# Altium schematic sheet Sheet_1_2021-03-24.schdoc
size 399 x 334 mm
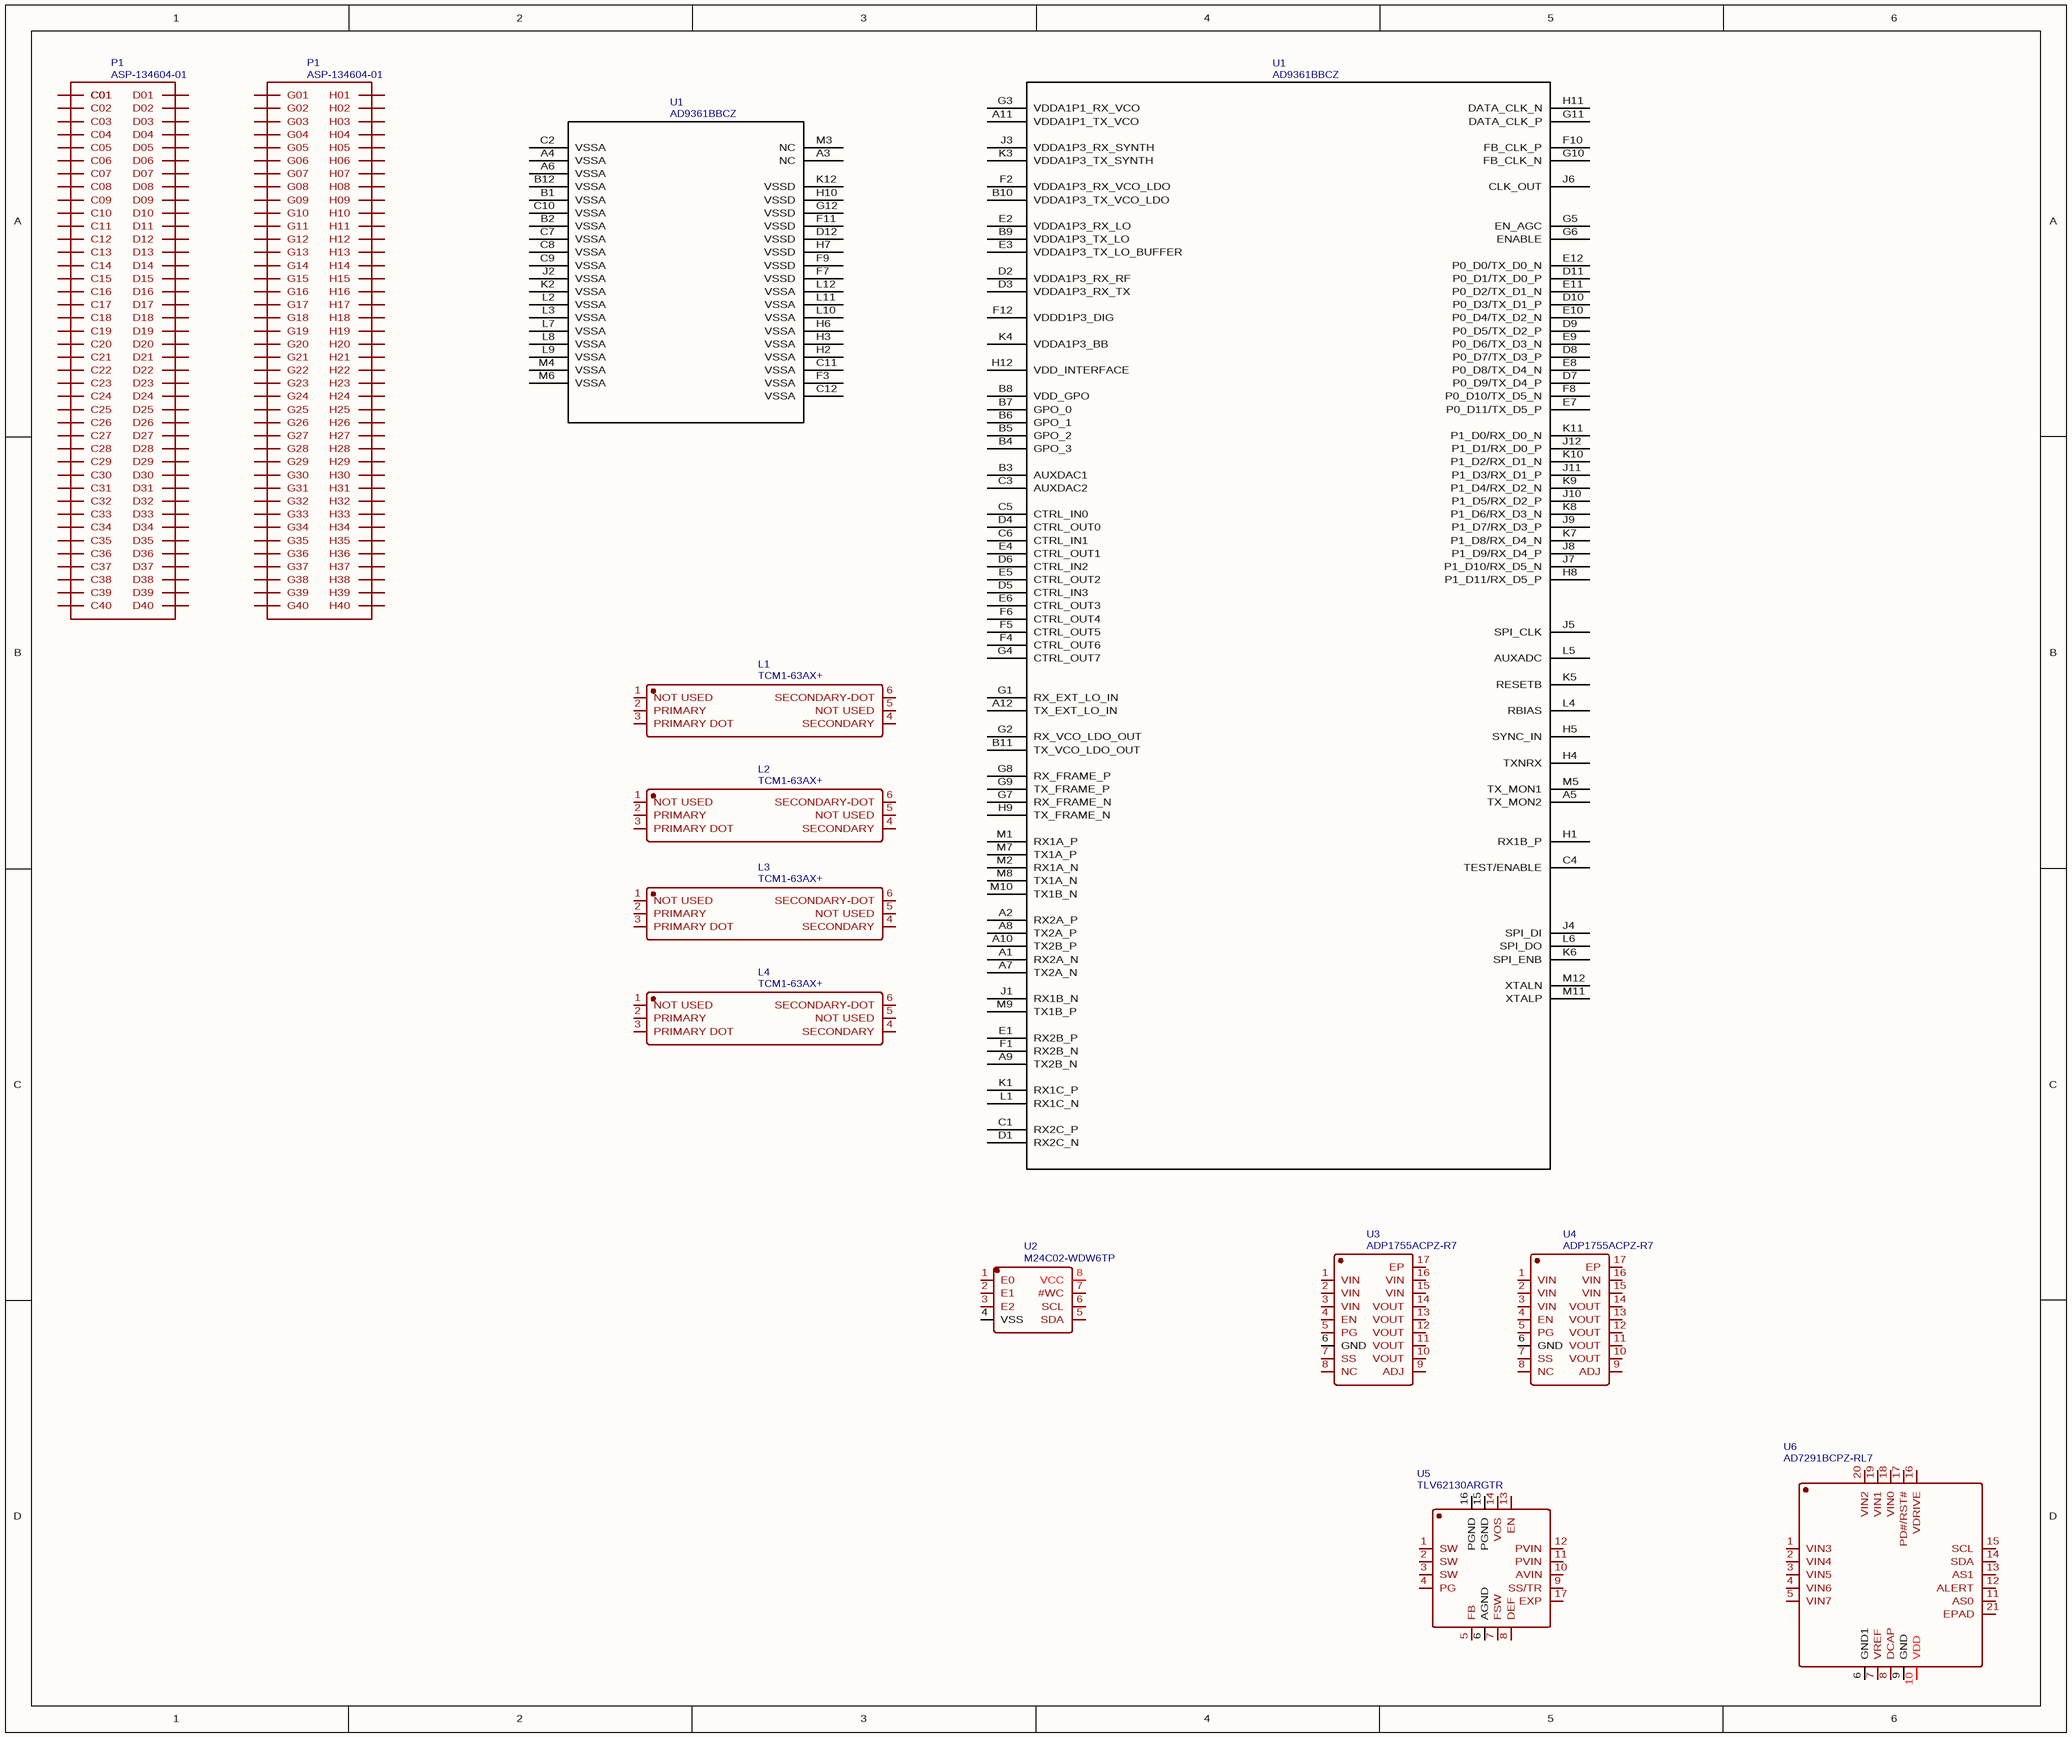
[diagram p0: Sheet_1_2021-03-24.schdoc]

## Parts
(Parts that share a designator on the sheet are numbered #1, #2 ... from top to bottom, then left to right.)
L1  TCM1-63AX+  [XFMR-SMD_TCM1-63AX]
L2  TCM1-63AX+  [XFMR-SMD_TCM1-63AX]
L3  TCM1-63AX+  [XFMR-SMD_TCM1-63AX]
L4  TCM1-63AX+  [XFMR-SMD_TCM1-63AX]
P1#1  ASP-134604-01  [ASP-134604-01]
P1#2  ASP-134604-01  [ASP-134604-01]
U1#1  AD9361BBCZ  [BC_144_7]
U1#2  AD9361BBCZ  [BC_144_7]
U2  M24C02-WDW6TP  [TSSOP-8_L4.4-W3.0-P0.65-LS6.4-BL]
U3  ADP1755ACPZ-R7  [LFCSP-WQ-16_L4.0-W4.0-P0.65-EP2.3-BL-EP]
U4  ADP1755ACPZ-R7  [LFCSP-WQ-16_L4.0-W4.0-P0.65-EP2.3-BL-EP]
U5  TLV62130ARGTR  [VQFN-16_L3.0-W3.0-P0.50-TL-EP1.8]
U6  AD7291BCPZ-RL7  [LFCSP-20_L4.0-W4.0-P0.50-TL-EP2.7]

## Nets

Not connected (* = marked no-connect by the designer): L1 1(NOT_USED) 2(PRIMARY) 3(PRIMARY_DOT) 4(SECONDARY) 5(NOT_USED) 6(SECONDARY-DOT); L2 1(NOT_USED) 2(PRIMARY) 3(PRIMARY_DOT) 4(SECONDARY) 5(NOT_USED) 6(SECONDARY-DOT); L3 1(NOT_USED) 2(PRIMARY) 3(PRIMARY_DOT) 4(SECONDARY) 5(NOT_USED) 6(SECONDARY-DOT); L4 1(NOT_USED) 2(PRIMARY) 3(PRIMARY_DOT) 4(SECONDARY) 5(NOT_USED) 6(SECONDARY-DOT); P1#1 C01 C02 C03 C04 C05 C06 C07 C08 C09 C10 C11 C12 C13 C14 C15 C16 C17 C18 C19 C20 C21 C22 C23 C24 C25 C26 C27 C28 C29 C30 C31 C32 C33 C34 C35 C36 C37 C38 C39 C40 D01 D02 D03 D04 D05 D06 D07 D08 D09 D10 D11 D12 D13 D14 D15 D16 D17 D18 D19 D20 D21 D22 D23 D24 D25 D26 D27 D28 D29 D30 D31 D32 D33 D34 D35 D36 D37 D38 D39 D40; P1#2 G01 G02 G03 G04 G05 G06 G07 G08 G09 G10 G11 G12 G13 G14 G15 G16 G17 G18 G19 G20 G21 G22 G23 G24 G25 G26 G27 G28 G29 G30 G31 G32 G33 G34 G35 G36 G37 G38 G39 G40 H01 H02 H03 H04 H05 H06 H07 H08 H09 H10 H11 H12 H13 H14 H15 H16 H17 H18 H19 H20 H21 H22 H23 H24 H25 H26 H27 H28 H29 H30 H31 H32 H33 H34 H35 H36 H37 H38 H39 H40; U1#1 A3(NC) A4(VSSA) A6(VSSA) B1(VSSA) B2(VSSA) B12(VSSA) C2(VSSA) C7(VSSA) C8(VSSA) C9(VSSA) C10(VSSA) C11(VSSA) C12(VSSA) D12(VSSD) F3(VSSA) F7(VSSD) F9(VSSD) F11(VSSD) G12(VSSD) H2(VSSA) H3(VSSA) H6(VSSA) H7(VSSD) H10(VSSD) J2(VSSA) K2(VSSA) K12(VSSD) L2(VSSA) L3(VSSA) L7(VSSA) L8(VSSA) L9(VSSA) L10(VSSA) L11(VSSA) L12(VSSA) M3(NC) M4(VSSA) M6(VSSA); U1#2 A1(RX2A_N) A2(RX2A_P) A5(TX_MON2) A7(TX2A_N) A8(TX2A_P) A9(TX2B_N) A10(TX2B_P) A11(VDDA1P1_TX_VCO) A12(TX_EXT_LO_IN) B3(AUXDAC1) B4(GPO_3) B5(GPO_2) B6(GPO_1) B7(GPO_0) B8(VDD_GPO) B9(VDDA1P3_TX_LO) B10(VDDA1P3_TX_VCO_LDO) B11(TX_VCO_LDO_OUT) C1(RX2C_P) C3(AUXDAC2) C4(TEST/ENABLE) C5(CTRL_IN0) C6(CTRL_IN1) D1(RX2C_N) D2(VDDA1P3_RX_RF) D3(VDDA1P3_RX_TX) D4(CTRL_OUT0) D5(CTRL_IN3) D6(CTRL_IN2) D7(P0_D9/TX_D4_P) D8(P0_D7/TX_D3_P) D9(P0_D5/TX_D2_P) D10(P0_D3/TX_D1_P) D11(P0_D1/TX_D0_P) E1(RX2B_P) E2(VDDA1P3_RX_LO) E3(VDDA1P3_TX_LO_BUFFER) E4(CTRL_OUT1) E5(CTRL_OUT2) E6(CTRL_OUT3) E7(P0_D11/TX_D5_P) E8(P0_D8/TX_D4_N) E9(P0_D6/TX_D3_N) E10(P0_D4/TX_D2_N) E11(P0_D2/TX_D1_N) E12(P0_D0/TX_D0_N) F1(RX2B_N) F2(VDDA1P3_RX_VCO_LDO) F4(CTRL_OUT6) F5(CTRL_OUT5) F6(CTRL_OUT4) F8(P0_D10/TX_D5_N) F10(FB_CLK_P) F12(VDDD1P3_DIG) G1(RX_EXT_LO_IN) G2(RX_VCO_LDO_OUT) G3(VDDA1P1_RX_VCO) G4(CTRL_OUT7) G5(EN_AGC) G6(ENABLE) G7(RX_FRAME_N) G8(RX_FRAME_P) G9(TX_FRAME_P) G10(FB_CLK_N) G11(DATA_CLK_P) H1(RX1B_P) H4(TXNRX) H5(SYNC_IN) H8(P1_D11/RX_D5_P) H9(TX_FRAME_N) H11(DATA_CLK_N) H12(VDD_INTERFACE) J1(RX1B_N) J3(VDDA1P3_RX_SYNTH) J4(SPI_DI) J5(SPI_CLK) J6(CLK_OUT) J7(P1_D10/RX_D5_N) J8(P1_D9/RX_D4_P) J9(P1_D7/RX_D3_P) J10(P1_D5/RX_D2_P) J11(P1_D3/RX_D1_P) J12(P1_D1/RX_D0_P) K1(RX1C_P) K3(VDDA1P3_TX_SYNTH) K4(VDDA1P3_BB) K5(RESETB) K6(SPI_ENB) K7(P1_D8/RX_D4_N) K8(P1_D6/RX_D3_N) K9(P1_D4/RX_D2_N) K10(P1_D2/RX_D1_N) K11(P1_D0/RX_D0_N) L1(RX1C_N) L4(RBIAS) L5(AUXADC) L6(SPI_DO) M1(RX1A_P) M2(RX1A_N) M5(TX_MON1) M7(TX1A_P) M8(TX1A_N) M9(TX1B_P) M10(TX1B_N) M11(XTALP) M12(XTALN); U2 1(E0) 2(E1) 3(E2) 4(VSS) 5(SDA) 6(SCL) 7(#WC) 8(VCC); U3 1(VIN) 2(VIN) 3(VIN) 4(EN) 5(PG) 6(GND) 7(SS) 8(NC) 9(ADJ) 10(VOUT) 11(VOUT) 12(VOUT) 13(VOUT) 14(VOUT) 15(VIN) 16(VIN) 17(EP); U4 1(VIN) 2(VIN) 3(VIN) 4(EN) 5(PG) 6(GND) 7(SS) 8(NC) 9(ADJ) 10(VOUT) 11(VOUT) 12(VOUT) 13(VOUT) 14(VOUT) 15(VIN) 16(VIN) 17(EP); U5 1(SW) 2(SW) 3(SW) 4(PG) 5(FB) 6(AGND) 7(FSW) 8(DEF) 9(SS/TR) 10(AVIN) 11(PVIN) 12(PVIN) 13(EN) 14(VOS) 15(PGND) 16(PGND) 17(EXP); U6 1(VIN3) 2(VIN4) 3(VIN5) 4(VIN6) 5(VIN7) 6(GND1) 7(VREF) 8(DCAP) 9(GND) 10(VDD) 11(AS0) 12(ALERT) 13(AS1) 14(SDA) 15(SCL) 16(VDRIVE) 17(PD#/RST#) 18(VIN0) 19(VIN1) 20(VIN2) 21(EPAD)

## Library data of the parts
L1-L4 = TCM1-63AX+: BOM_Manufacturer: Mini-Circuits; Contributor: LCSC; BOM_Supplier: LCSC; BOM_Supplier Part: C494678; BOM_Manufacturer Part: TCM1-63AX+; spicePre: L; spiceSymbolName: TCM1-63AX+
P1#1 P1#2 = ASP-134604-01: BOM_Manufacturer: Samtec; subpart_no: 1; BOM_Description: ASP-134604-01 -  Board-To-Board Connector, Vita 57 XMC, 1.27 mm, 160 Contacts, Header, ASP Series, Surface Mount; Contributor: longt; spicePre: X; BOM_Supplier Part: 2433507; BOM_Manufacturer Part: ASP-134604-01; spiceSymbolName: ASP-134604-01
U1#1 U1#2 = AD9361BBCZ: subpart_no: 1; Contributor: weapon_666; spicePre: U; spiceSymbolName: AD9361BBCZ
U2 = M24C02-WDW6TP: BOM_Manufacturer: STMicroelectronics; Contributor: LCSC; BOM_Paste Type: expand; BOM_Supplier: LCSC; BOM_Supplier Part: C283436; BOM_Manufacturer Part: M24C02-WDW6TP; spicePre: U; spiceSymbolName: M24C02-WDW6TP
U3 U4 = ADP1755ACPZ-R7: BOM_Manufacturer: Analog Devices; Contributor: LCSC; BOM_Paste Type: expand; BOM_Supplier: LCSC; BOM_Supplier Part: C403695; BOM_Manufacturer Part: ADP1755ACPZ-R7; spicePre: U; spiceSymbolName: ADP1755ACPZ-R7
U5 = TLV62130ARGTR: BOM_Manufacturer: TI; Contributor: LCSC; BOM_Paste Type: expand; BOM_Supplier: LCSC; BOM_Manufacturer Part: TLV62130ARGTR; BOM_Supplier Part: C138520; spicePre: U; spiceSymbolName: TLV62130ARGTR
U6 = AD7291BCPZ-RL7: BOM_Manufacturer: Analog Devices; Contributor: LCSC; BOM_Paste Type: expand; BOM_Supplier: LCSC; BOM_Supplier Part: C207434; BOM_Manufacturer Part: AD7291BCPZ-RL7; spicePre: U; spiceSymbolName: AD7291BCPZ-RL7